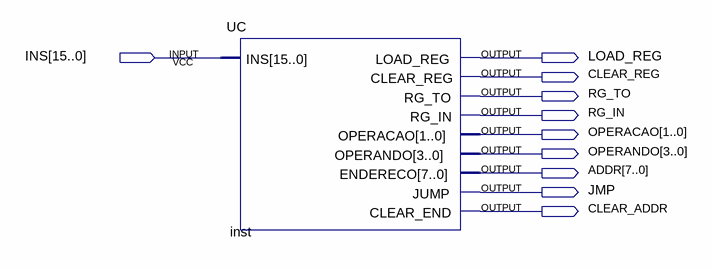
[diagram p0: schematic sheet]
// Quartus schematic TESTE_UC.bdf as structural Verilog: 1 symbols, 10 pins
module TESTE_UC (
  input  [15:0] INS,
  output LOAD_REG,
  output CLEAR_REG,
  output RG_TO,
  output RG_IN,
  output [1:0] OPERACAO,
  output [3:0] OPERANDO,
  output [7:0] ADDR,
  output JMP,
  output CLEAR_ADDR
);

  UC inst (
    .INS(INS), .LOAD_REG(LOAD_REG), .CLEAR_REG(CLEAR_REG), .RG_TO(RG_TO), .RG_IN(RG_IN), .OPERACAO(OPERACAO),
    .OPERANDO(OPERANDO), .ENDERECO(ADDR), .JUMP(JMP), .CLEAR_END(CLEAR_ADDR));
endmodule
